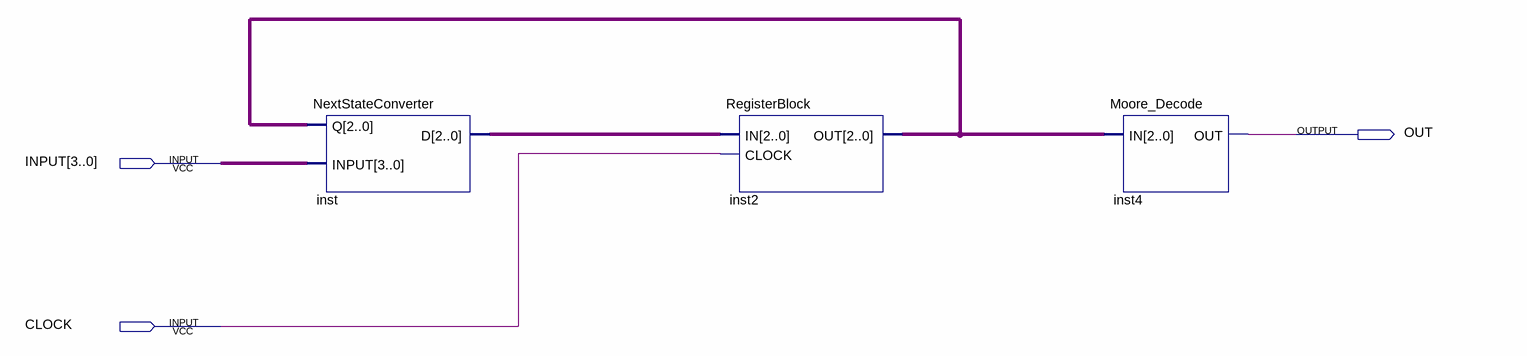
[diagram p0: schematic sheet]
// Quartus schematic LAB2.bdf as structural Verilog: 3 symbols, 3 pins
module LAB2 (
  input  [3:0] INPUT,
  input  CLOCK,
  output OUT
);

  wire [2:0] inst2_out, inst_d;

  NextStateConverter inst (.INPUT(INPUT), .Q(inst2_out), .D(inst_d));
  RegisterBlock inst2 (.IN(inst_d), .CLOCK(CLOCK), .OUT(inst2_out));
  Moore_Decode inst4 (.IN(inst2_out), .OUT(OUT));
endmodule
